# EAGLE design BreakoutBoardMAX (EAGLE 8.4.2)
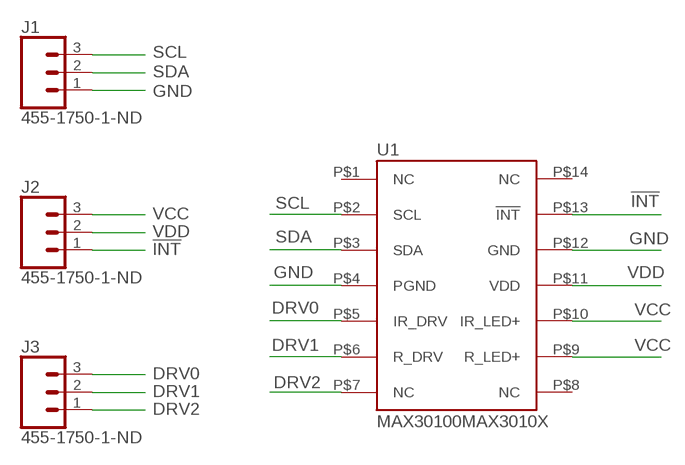
[diagram p0: schematic, sheet 1]

## Parts
J1  455-1750-1-ND  CONN_03  [1X03]
J2  455-1750-1-ND  CONN_03  [1X03]
J3  455-1750-1-ND  CONN_03  [1X03]
U1  MAX30100MAX3010X  [MAX_VERSATILE]

## Nets
!INT!: J2.1 U1.P$13(!INT!)
DRV0: J3.3 U1.P$5(IR_DRV)
DRV1: J3.2 U1.P$6(R_DRV)
DRV2: J3.1 U1.P$7(NC)
GND: J1.1 U1.P$4(PGND) U1.P$12(GND)
SCL: J1.3 U1.P$2(SCL)
SDA: J1.2 U1.P$3(SDA)
VCC: J2.3 U1.P$9(R_LED+) U1.P$10(IR_LED+)
VDD: J2.2 U1.P$11(VDD)
Unconnected: U1.P$1(NC) U1.P$8(NC) U1.P$14(NC)

## Library data of the parts
J1-J3 = SparkFun-Connectors:CONN_03: Multi connection point. Often used as Generic Header-pin footprint for 0.1 inch spaced/style header connections On any of the 0.1 inch spaced packages, you can populate with these: Break Away Headers - Straight <https://www.sparkfun.com/products/116> (PRT-00116) Break Away Male Headers - Right Angle <https://www.sparkfun.com/products/553> (PRT-00553) Female Headers <https://www.sparkfun.com/products/115> (PRT-00115) Break Away Headers - Machine Pin <https://www.sparkfun.com/products/117> (PRT-00117) Break Away Female Headers - Swiss Machine Pin <https://www.sparkfun.com/products/743> (PRT-00743) Stackable Header - 3 Pin (Female, 0.1") <https://www.sparkfun.com/products/13875> (PRT-13875) For SCREWTERMINALS and SPRING TERMINALS visit here: Screw Terimnals on SparkFun.com <https://www.sparkfun.com/search/results?term=Screw+Terminals> (5mm/3.5mm/2.54mm spacing) This device is also useful as a general connection point to wire up your design to another part of your project. Our various solder wires solder well into these plated through hole pads. Hook-Up Wire - Assortment (Stranded, 22 AWG) <https://www.sparkfun.com/products/11375> (PRT-11375) Hook-Up Wire - Assortment (Solid Core, 22 AWG) <https://www.sparkfun.com/products/11367> (PRT-11367) View the entire wire category on our website here <https://www.sparkfun.com/categories/141> Special notes: Molex polarized connector foot print use with SKU : PRT-08232 with associated crimp pins and housings.; PROD_ID: XXX-00000
U1 = CustomLibrary:MAX30100: MAX30100

## Board
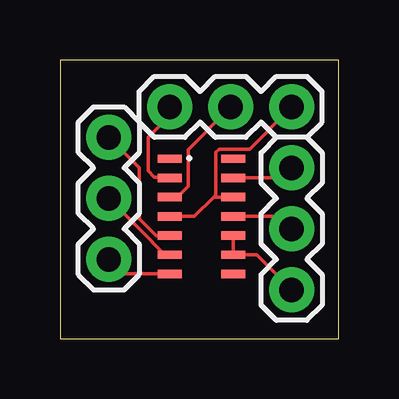
[diagram p1: board, top side]
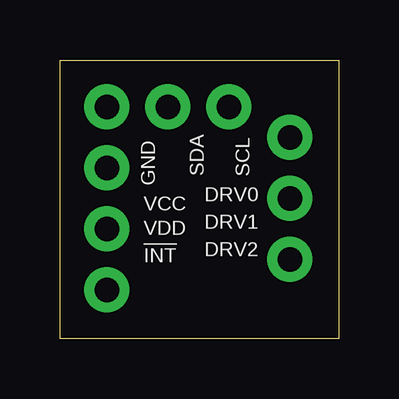
[diagram p2: board, bottom side, seen from below]

Size 11.61 x 11.61 mm. Coordinates in mm from the lower left corner, seen from the top.
Outline: 0,0 11.61,0 11.61,11.61 0,11.61 0,0
Copper layers (1*16): Top 0.035mm / dielectric 1.5mm / Bottom 0.035mm
Design rules "default": minimum track width 6mil, minimum drill 0.35mm, track to track 6mil, track to pad 6mil, pad to pad 6mil, via to via 6mil, smd to smd 6mil, copper to edge 40mil, drill to drill 6mil, minimum pad ring 10mil, minimum via ring 8mil, stop-mask expansion 4mil, vias tented up to drill 0mil, thermal gap 10mil

### Footprints (pad centres in the part's own frame; a part is rotated, then mirrored left to right if it is on the bottom)
1X03 = drill 1.016 pad 1.88: 1 0,0; 2 2.54,0; 3 5.08,0
MAX_VERSATILE = smd 1 x 0.35: P$1 0,0; P$2 0,-0.8; P$3 0,-1.6; P$4 0,-2.4; P$5 0,-3.2; P$6 0,-4; P$7 0,-4.8; P$8 2.65,-4.8; P$9 2.65,-4; P$10 2.65,-3.2; P$11 2.65,-2.4; P$12 2.65,-1.6; P$13 2.65,-0.8; P$14 2.65,0

### Placement (x,y rotation side)
J1  9.65,9.65 180 top
J2  9.65,7.11 270 top
J3  2.03,3.3 90 top
U1  4.57,7.49 0 top

### Tracks (layer width: path | path; a pad name or v marks a point on that pad's centre or on a via)
!INT!
  Top 0.152: J2.1 9.23,6.69 U1.P$13
DRV0
  Top 0.152: J3.3 3.3,7.11 3.3,5 4.01,4.29 U1.P$5
DRV1
  Top 0.152: J3.2 3.84,4.03 3.84,4.02 4.37,3.49 U1.P$6
DRV2
  Top 0.152: U1.P$7 2.64,2.69 J3.1
GND
  Top 0.152: U1.P$4 5.6,5.09 6.4,5.89 | U1.P$12 6.4,5.89 | 6.4,5.89 6.49,5.99 6.49,7.76 6.63,7.9 7.9,7.9 J1.1
SCL
  Top 0.152: J1.3 4.57,9.27 3.68,8.38 3.68,6.99 3.94,6.73 4.53,6.73 U1.P$2
SDA
  Top 0.152: U1.P$3 4.88,5.89 5.33,6.35 5.33,7.87 J1.2
VCC
  Top 0.152: U1.P$10 U1.P$9 8.19,3.49 J2.3
VDD
  Top 0.152: J2.2 9.13,5.09 U1.P$11

### Text on the board
bPlace: SDA | SCL | GND | DRV0 | DRV1 | VCC | VDD | DRV2 | !INT!